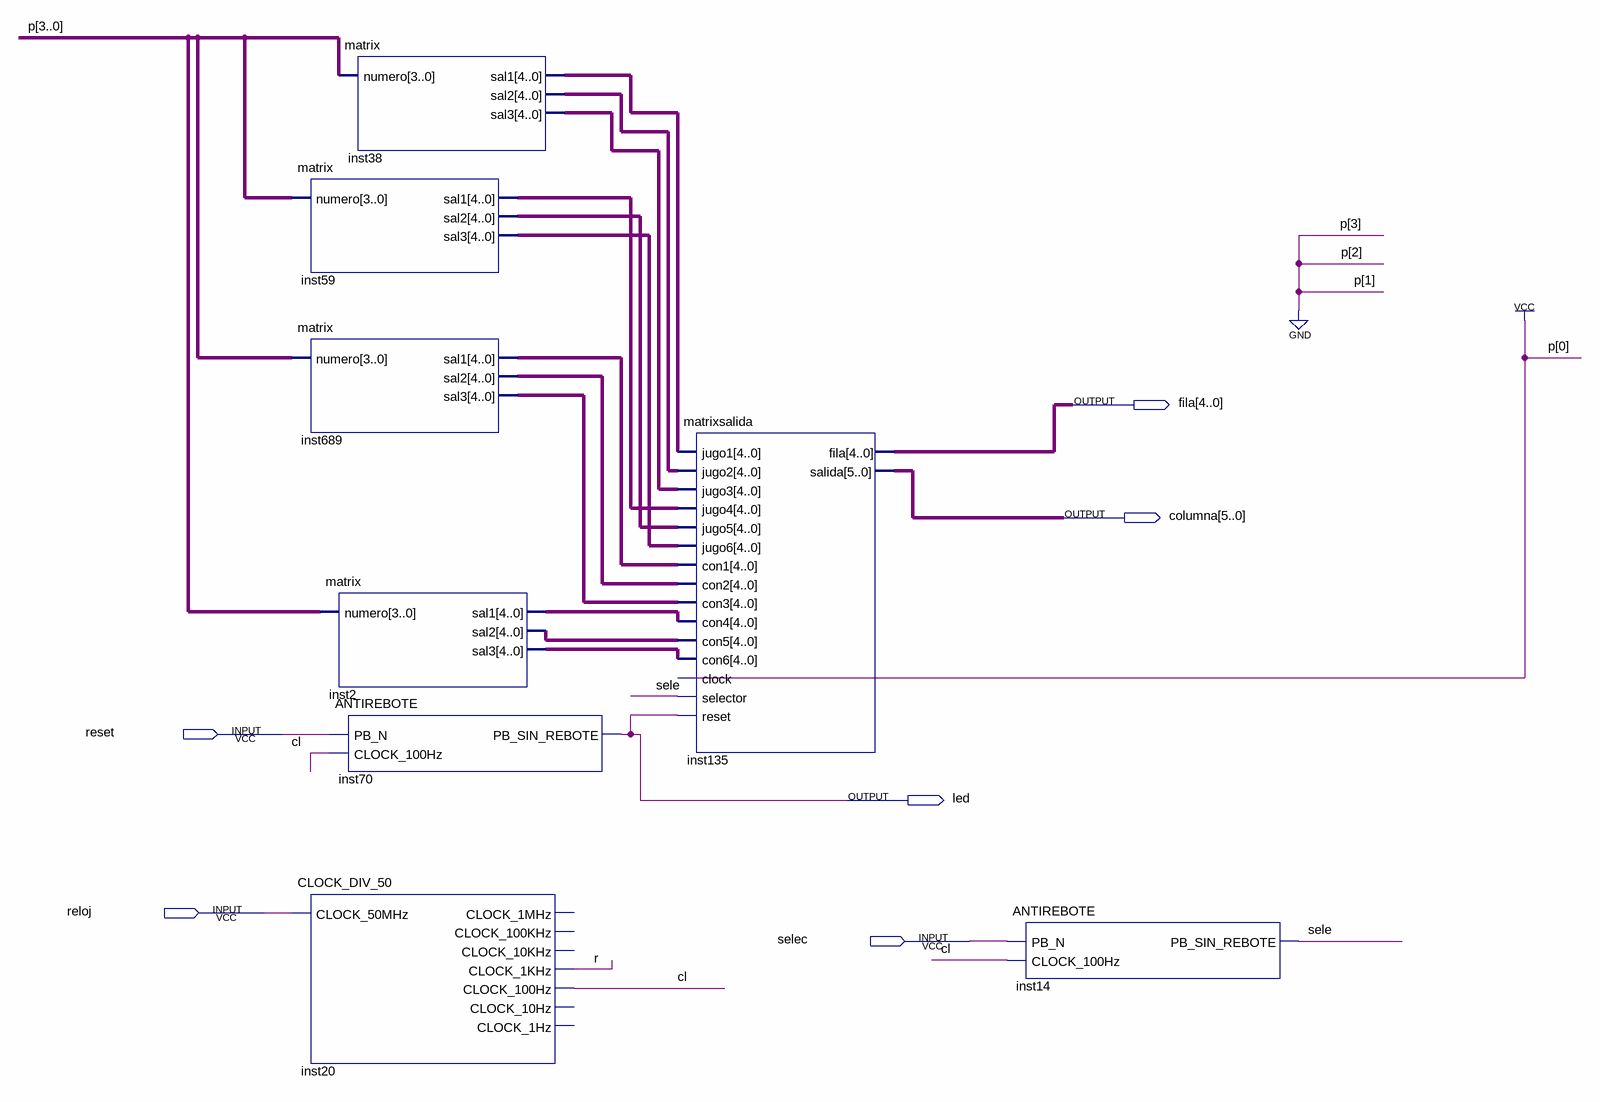
[diagram p0: schematic sheet]
// Quartus schematic Block1.bdf as structural Verilog: 8 symbols, 6 pins
module Block1 (
  input  reset,
  input  reloj,
  input  selec,
  output [4:0] fila,
  output [5:0] columna,
  output led
);

  wire cl, r, sele;
  wire [4:0] inst2_sal1, inst2_sal2, inst2_sal3, inst38_sal1, inst38_sal2, inst38_sal3, inst59_sal1,
       inst59_sal2, inst59_sal3, inst689_sal1, inst689_sal2, inst689_sal3;

  matrix inst59 (.numero(4'b0001), .sal1(inst59_sal1), .sal2(inst59_sal2), .sal3(inst59_sal3));
  matrix inst689 (.numero(4'b0001), .sal1(inst689_sal1), .sal2(inst689_sal2), .sal3(inst689_sal3));
  CLOCK_DIV_50 inst20 (
    .CLOCK_50MHz(reloj), .CLOCK_1KHz(r), .CLOCK_100Hz(cl));  // open: CLOCK_1MHz, CLOCK_100KHz, CLOCK_10KHz, CLOCK_10Hz, CLOCK_1Hz
  matrix inst38 (.numero(4'b0001), .sal1(inst38_sal1), .sal2(inst38_sal2), .sal3(inst38_sal3));
  matrix inst2 (.numero(4'b0001), .sal1(inst2_sal1), .sal2(inst2_sal2), .sal3(inst2_sal3));
  ANTIREBOTE inst70 (.PB_N(reset), .CLOCK_100Hz(cl), .PB_SIN_REBOTE(led));
  matrixsalida inst135 (
    .jugo1(inst38_sal1), .jugo2(inst38_sal2), .jugo3(inst38_sal3), .jugo4(inst59_sal1), .jugo5(inst59_sal2),
    .jugo6(inst59_sal3), .con1(inst689_sal1), .con2(inst689_sal2), .con3(inst689_sal3), .con4(inst2_sal1),
    .con5(inst2_sal2), .con6(inst2_sal3), .clock(1'b1), .selector(sele), .reset(led), .fila(fila),
    .salida(columna));
  ANTIREBOTE inst14 (.PB_N(selec), .CLOCK_100Hz(cl), .PB_SIN_REBOTE(sele));
endmodule
